# Altium project PAPI_M3_RF.PrjPcb
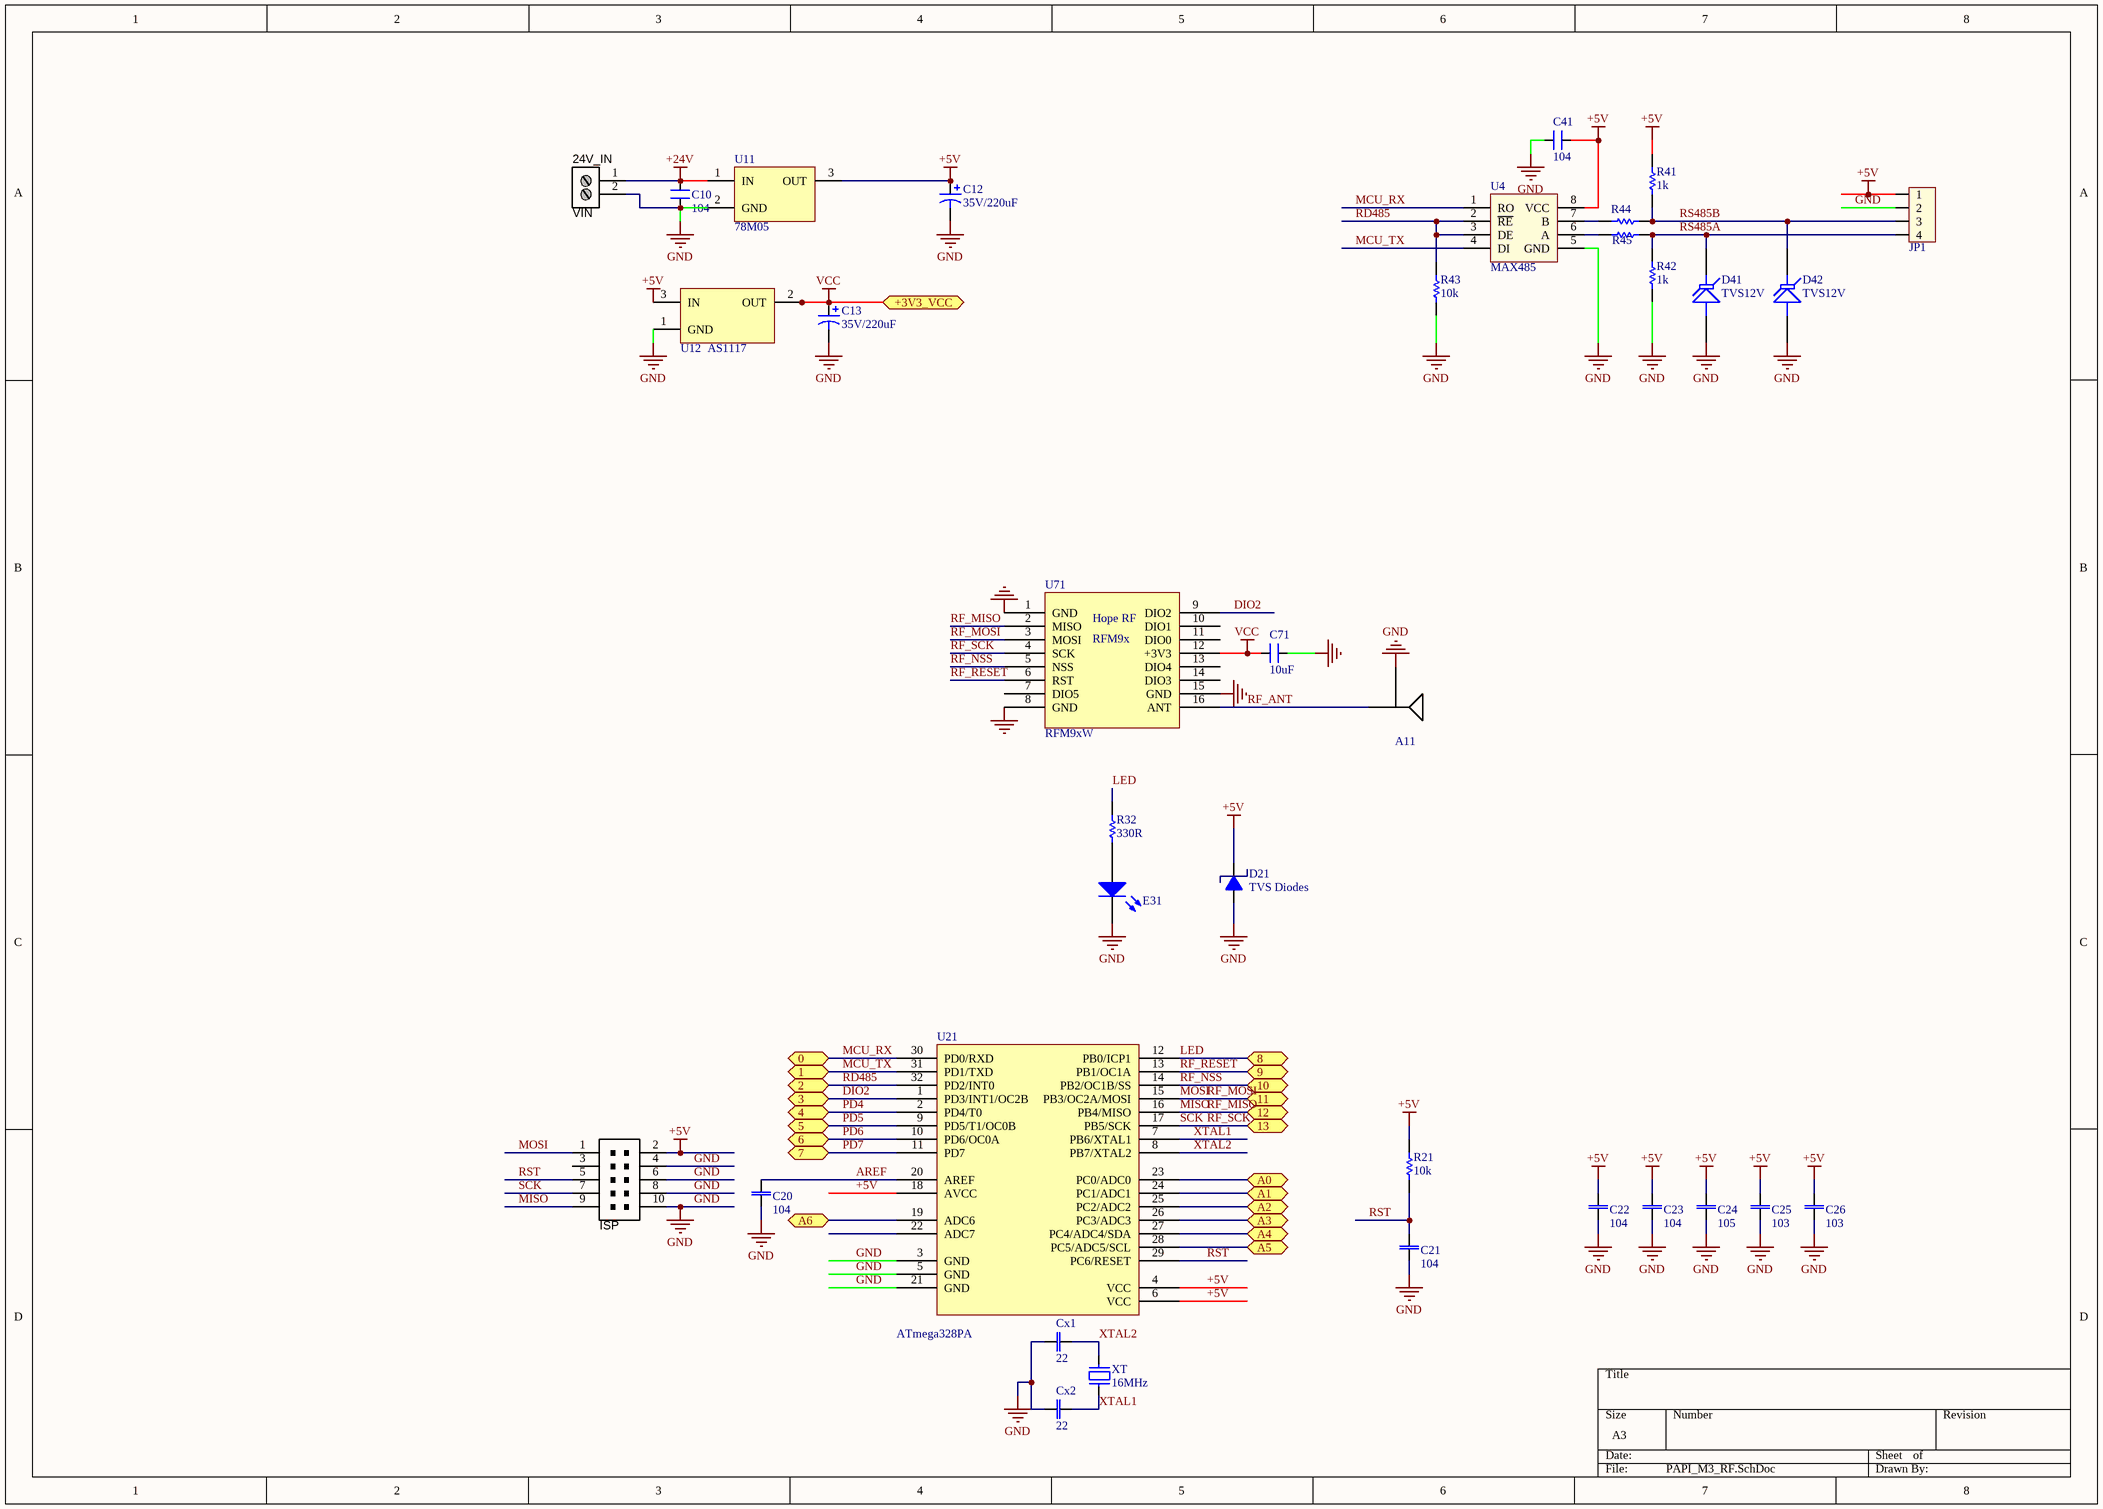
[diagram p0: PAPI_M3_RF.SchDoc]
1 sheet, 35 parts. Net scope: flat (ports and power ports of the same name join across sheets).
Board file: PAPI_M3_RF.PcbDoc

## Sheet PAPI_M3_RF.SchDoc
size A3; PageSetup: Record=PageOptions|CenterHorizontal=True|CenterVertical=True|PrintScale=1.04|XCorrection=1.00|YCorrection=1.00|PrintKind=1|BorderSize=5000000|LeftOffset=0|BottomOffset=0|Orientation=2|PaperLength=1000|PaperWidth=1000|Scale=100|PaperSource=15|PrintQuality=1200|MediaType=1|DitherType=10|PrintScaleMode=1|PaperKind=A3|PaperIndex=8

### Parts
24V_IN  VIN  [2P_PCB1]
A11  Giắc anten SMA  [SMA]  (value not drawn)
C10  value 104  [CAPC2012N_F]  (hidden comment: Cap_104_0603)
C12  value 35V/220uF  [CAPE3.5-5.0MM_Rad_10x14mm]  (hidden comment: Cap)
C13  value 35V/220uF  [CAPE3.5-5.0MM_Rad_10x14mm]  (hidden comment: Cap)
C20  value 104  [CAPC2012N_F]  (hidden comment: Tụ điện dán 0603104)
C21  value 104  [CAPC2012N_F]  (hidden comment: Tụ điện dán 0603104)
C22  value 104  [CAPC2012N_F]  (hidden comment: Tụ điện dán 0805104)
C23  value 104  [CAPC2012N_F]  (hidden comment: Tụ điện dán 0805104)
C24  value 105  [CAPC2012N_F]  (hidden comment: Tụ điện dán 0805105)
C25  value 103  [CAPC2012N_F]  (hidden comment: Tụ điện dán 0805103)
C26  value 103  [CAPC2012N_F]  (hidden comment: Tụ điện dán 0805103)
C41  value 104  [CAPC2012N_F]  (hidden comment: Cap_104_0603)
C71  value 10uF  [CAPC2012N_F]  (hidden comment: Cap_10uF_0805)
Cx1  value 22  [CAPC2012N_F]  (hidden comment: Tụ điện dán 060322)
Cx2  value 22  [CAPC2012N_F]  (hidden comment: Tụ điện dán 060322)
D21  TVS Diodes  [DO-214AC]
D41  TVS12V  [DO-214AA]
D42  TVS12V  [DO-214AA]
E31  Led  [LED 5mm Green]  (value not drawn)
ISP  Giắc đôi 5x2 chân 2.54mm  [10P_PCB_HEADER_BRD_MNT]  (value not drawn)
JP1  JP4  [CON4]  (value not drawn)
R21  value 10k  [RESC2012N_F]  (hidden comment: Điện trở dán 060310k)
R32  value 330R  [RESC2012N_F]  (hidden comment: Điện trở dán 0603330R)
R41  value 1k  [RESC2012N_F]  (hidden comment: Res_1k_0603)
R42  value 1k  [RESC2012N_F]  (hidden comment: Res_1k_0603)
R43  value 10k  [RESC2012N_F]  (hidden comment: Res_10k_0603)
R44  Res_10R_0805  [RESC2012N_F]  (value not drawn)
R45  Res_10R_0805  [RESC2012N_F]  (value not drawn)
U4  MAX485  [SOIC 8]
U11  78M05  [TO252 D-PAK]
U12  AS1117  [SOT223-4N]
U21  ATmega328PA  [TQFP32]
U71  RFM9xW  [RFM9xW]
XT  16MHz  [XT2]

### Ports
0, 1, 2, 3, 4, 5, 6, 7, 8, 9, 10, 11, 12, 13, +3V3_VCC, A0, A1, A2, A3, A4, A5, A6

### Nets
+5V: C12.1 C22.2 C23.2 C24.2 C25.2 C26.2 C41.1 D21.K ISP.2 JP1.1 R21.2 R41.2 U4.8(VCC) U11.3(OUT) U12.3(IN) U21.4(VCC) U21.6(VCC) U21.18(AVCC)
+24V: 24V_IN.1 C10.2 U11.1(IN)
GND: 24V_IN.2 A11.2(G) C10.1 C12.2 C13.2 C20.1 C21.1 C22.1 C23.1 C24.1 C25.1 C26.1 C41.2 C71.1 Cx1.2 Cx2.2 D21.A D41.1(A) D42.1(A) E31.2(K) ISP.4 ISP.6 ISP.8 ISP.10 JP1.2 R42.1 R43.1 U4.5(GND) U11.2(GND) U12.1(GND) U21.3(GND) U21.5(GND) U21.21(GND) U71.1(GND) U71.8(GND) U71.15(GND)
VCC: C13.1 C71.2 U12.2(OUT) U12.4 U71.12(+3V3) ; port +3V3_VCC
AREF: C20.2 U21.20(AREF)
DIO2: U21.1(PD3/INT1/OC2B) U71.9(DIO2) ; port 3
LED: R32.1 U21.12(PB0/ICP1) ; port 8
MCU_RX: U4.1(RO) U21.30(PD0/RXD) ; port 0
MCU_TX: U4.4(DI) U21.31(PD1/TXD) ; port 1
MISO: ISP.9 U21.16(PB4/MISO) U71.2(MISO) ; port 12  [also labelled RF_MISO]
MOSI: ISP.1 U21.15(PB3/OC2A/MOSI) U71.3(MOSI) ; port 11  [also labelled RF_MOSI]
PD4: U21.2(PD4/T0) ; port 4
PD5: U21.9(PD5/T1/OC0B) ; port 5
PD6: U21.10(PD6/OC0A) ; port 6
PD7: U21.11(PD7) ; port 7
RD485: R43.2 U4.2(~{RE}) U4.3(DE) U21.32(PD2/INT0) ; port 2
RF_ANT: A11.1(RF) U71.16(ANT)
RF_NSS: U21.14(PB2/OC1B/SS) U71.5(NSS) ; port 10
RF_RESET: U21.13(PB1/OC1A) U71.6(RST) ; port 9
RF_SCK: ISP.7 U21.17(PB5/SCK) U71.4(SCK) ; port 13  [also labelled SCK]
RS485A: D41.2(K) JP1.4 R42.2 R45.2
RS485B: D42.2(K) JP1.3 R41.1 R44.2
RST: C21.2 ISP.5 R21.1 U21.29(PC6/RESET)
XTAL1: Cx2.1 U21.7(PB6/XTAL1) XT.1
XTAL2: Cx1.1 U21.8(PB7/XTAL2) XT.2
NetE31_1: E31.1(A) R32.2
NetR44_1: R44.1 U4.7(B)
NetR45_1: R45.1 U4.6(A)
NetU21_19: U21.19(ADC6) ; port A6
NetU21_23: U21.23(PC0/ADC0) ; port A0
NetU21_24: U21.24(PC1/ADC1) ; port A1
NetU21_25: U21.25(PC2/ADC2) ; port A2
NetU21_26: U21.26(PC3/ADC3) ; port A3
NetU21_27: U21.27(PC4/ADC4/SDA) ; port A4
NetU21_28: U21.28(PC5/ADC5/SCL) ; port A5

Not connected (* = marked no-connect by the designer): ISP 3; U21 22(ADC7); U71 7(DIO5) 10(DIO1) 11(DIO0) 13(DIO4) 14(DIO3)

### Notes on the sheet
- (in symbol RFM9xW) Hope RF; RFM9x

### Library data of the parts
24V_IN = 2P_ScrewTerm_90S_3.81MM: Terminal Block Screw Type THT 2-Position 3.81mm pitch; Manufacturer 1: Tyco Electronics; Manufacturer Part Number 1: 1776113-2; Value: 2 position; Pitch: 0.150" (3.81mm); Positions Per Level: 2; Package / Case: Side Entry; 3.81mm pitch; Category: Connectors Interconnects; Color: Black; Supplier 1: Digi-Key; Supplier Part Number 1: A97976-ND
A11 = RF_SMA
C10 C41 C71 = CAP NP
C20 C21 Cx1 Cx2 = CAP NP: Capacitor non polarized; cm2: Tụ điện dán 0805; cm3: Tụ điện dán 1206; cm1: Tụ điện dán 0603
C22-C26 = CAP NP: Capacitor non polarized; cm1: Tụ điện dán 0603; cm3: Tụ điện dán 1206; cm2: Tụ điện dán 0805
D21 = TVS Diodes: TVS Diodes - Transient Voltage Suppressors; SMBJ12CA-E3/52: 12V,600W,DO-214AA; SMAJ5.0A: TVS Diodes - Transient Voltage Suppressors 5volts 400watts UniDirectional
D41 D42 = Tranzorb: Transient Voltage Suppression (TVS) Diode; pin to pad: 1>A 2>K; Published: 24-Mar-1999; LatestRevisionDate: 17-Jul-2002; LatestRevisionNote: Re-released for DXP Platform.; PackageReference: DO-7; Publisher: Altium Limited; PackageDescription: Axial Lead Diode
ISP = CONN_HEADER_2x5P_0.100in_Male: Header THD 10 POS Double-row 2.54mm pitch; Manufacturer 1: 3M; Manufacturer Part Number 1: D2510-6002-AR; Pitch: 0.100" (2.54mm); Value: Double-row, 10 positions; QtyOverride: 1; Connector Type: Header, Shrouded; Number of Positions: 10; Package / Case: Connector header; 2.54mm pitch; Contact Type: Male Pin; Number of Rows: 2; Row Spacing: 0.100" (2.54mm); Contact Mating Length: 0.243" (6.17mm); ComponentLink1URL: http://multimedia.3m.com/mws/mediawebserver?66666UuZjcFSLXTtm8T_oxMcEVuQEcuZgVs6EVs6E666666--; ComponentLink1Description: http://multimedia.3m.com/mws/mediawebserver?66666UuZjcFSLXTtm8T_oxMcEVuQEcuZgVs6EVs6E666666--; Supplier 1: Digi-Key; Supplier Part Number 1: MHC10E-ND
JP1 = Con4: Connector 4; Value: Connector 4
R21 R32 = Res: Resistor; cm2: Điện trở cắm 1/4W; cm3: Điện trở dán 0805; cm4: Điện trở dán 1206; cm1: Điện trở dán 0603
R41-R43 = Res
R44 R45 = Res: Value: 10R
U4 = MAX485: RS232 - RS485 (Same sn75176)
U11 = LM78xx
U21 = ATmega48/168/328
XT = Crystal